# EAGLE schematic Top (EAGLE 9.2.2)

## Sheet 1 of 3
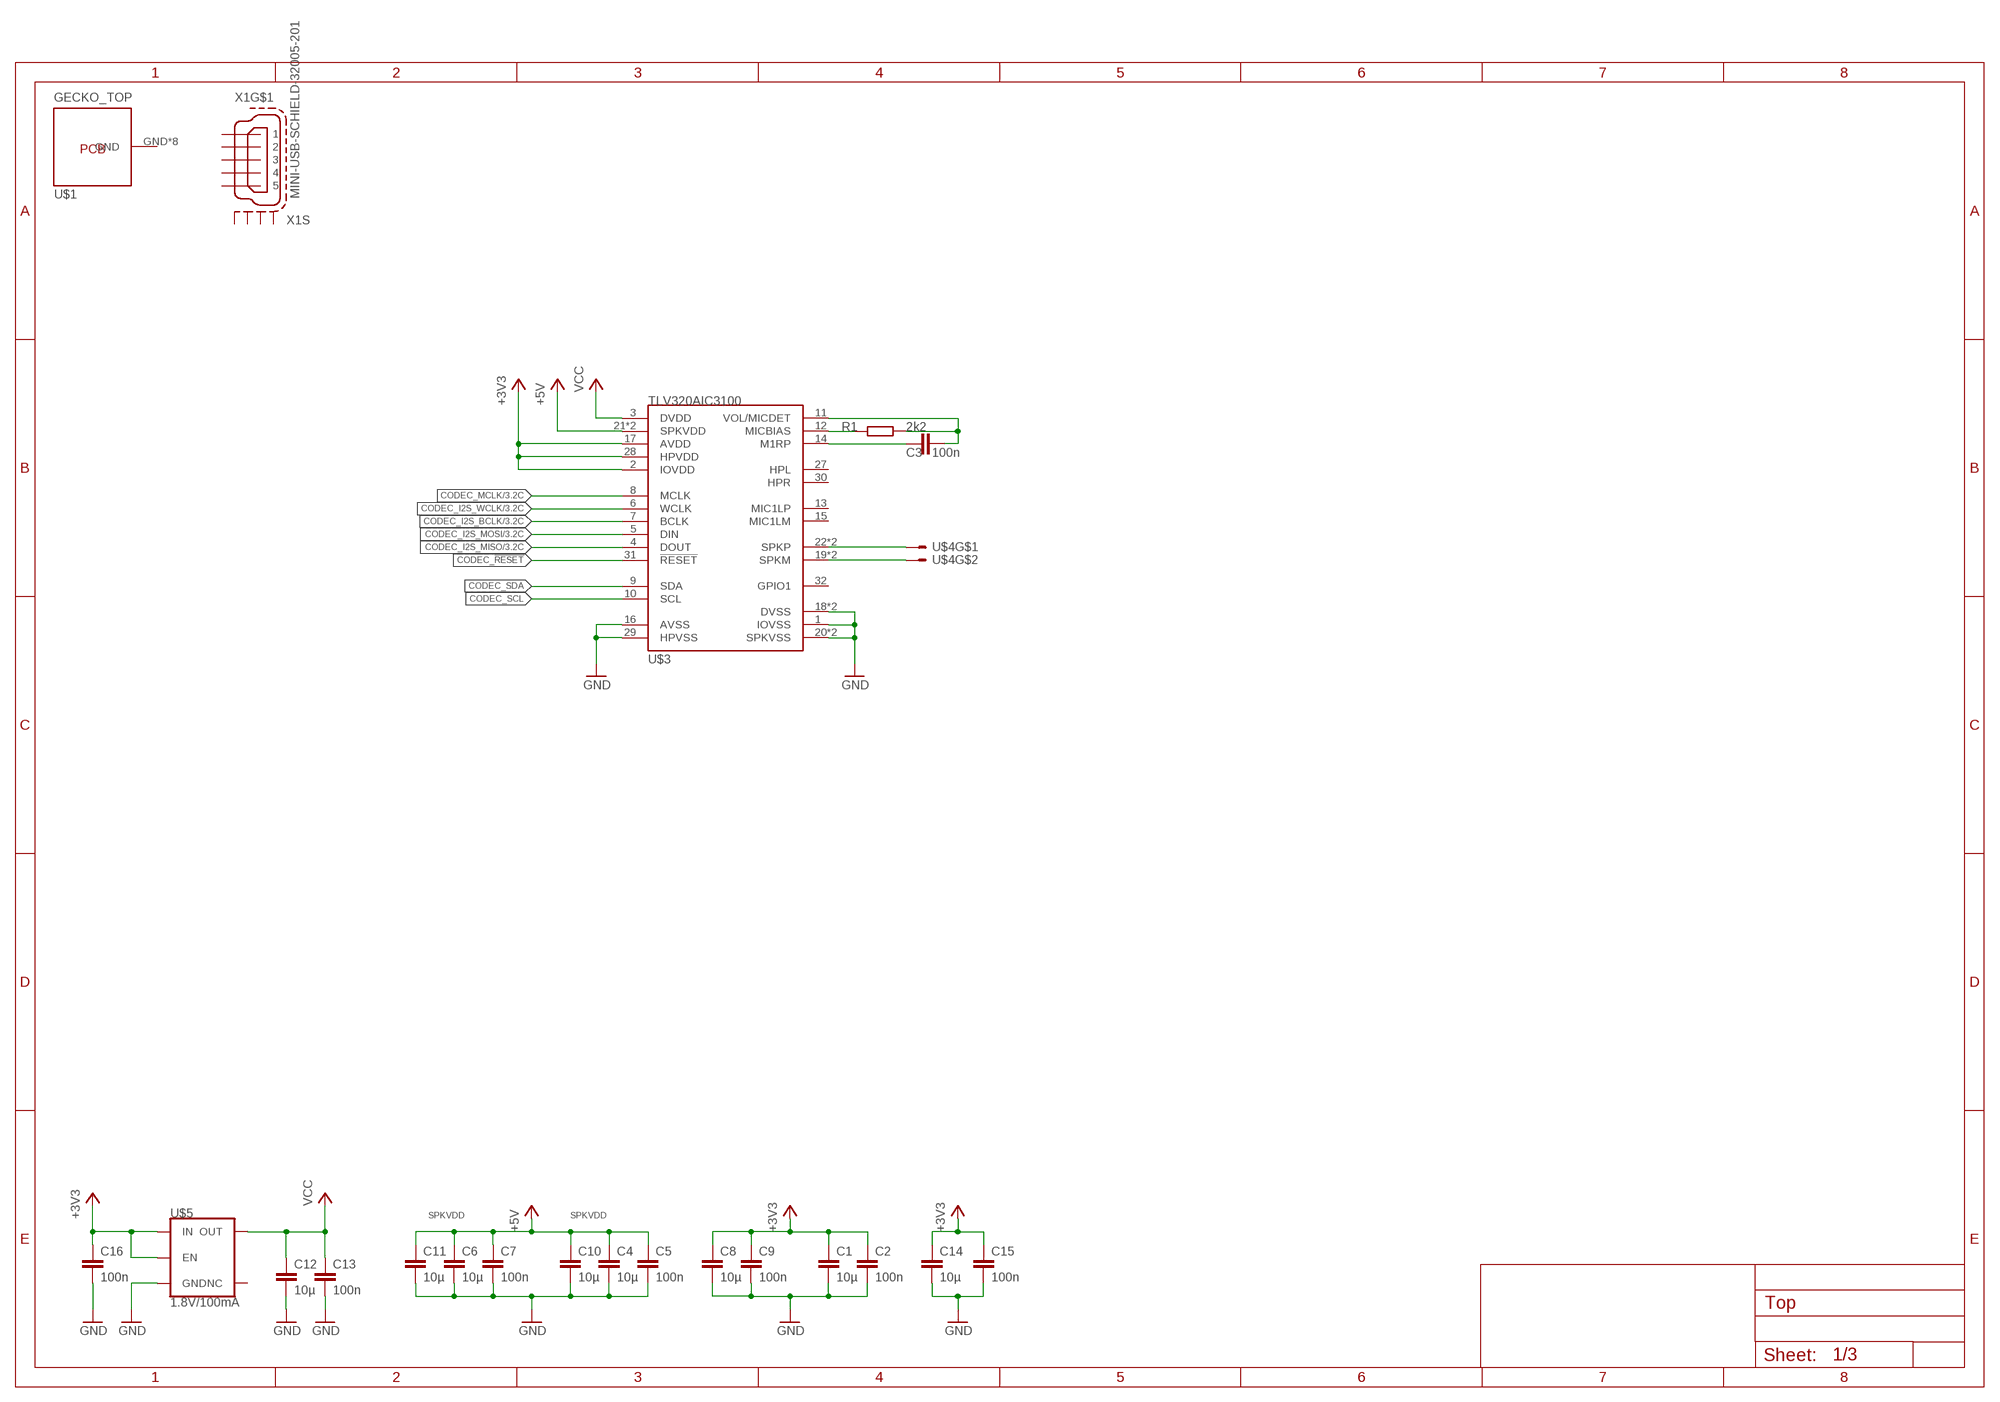
[diagram p0: schematic, sheet 1]

### Parts
C1  10µ  C-EUC0805  [C0805]
C2  100n  C-EUC0805  [C0805]
C3  100n  C-EUC0805  [C0805]
C4  10µ  C-EUC0805  [C0805]
C5  100n  C-EUC0805  [C0805]
C6  10µ  C-EUC0805  [C0805]
C7  100n  C-EUC0805  [C0805]
C8  10µ  C-EUC0805  [C0805]
C9  100n  C-EUC0805  [C0805]
C10  10µ  C-EUC0805  [C0805]
C11  10µ  C-EUC0805  [C0805]
C12  10µ  C-EUC0805  [C0805]
C13  100n  C-EUC0805  [C0805]
C14  10µ  C-EUC0805  [C0805]
C15  100n  C-EUC0805  [C0805]
C16  100n  C-EUC0805  [C0805]
R1  2k2  R-EU_R0402  [R0402]
U$1  GECKO_TOP  [GECKO_TOP]
U$3  TLV320AIC3100  [QFN32]
U$4  JST-SH-2-SMT  [JST-SH-2-SMT]
U$5  1.8V/100mA  V_REG_SP6214-1.8V  [SC70]
X1  MINI-USB-SCHIELD-32005-201  [32005-201]

### Nets
+3V3: C1.1 C2.1 C8.1 C9.1 C14.1 C15.1 C16.1 U$3.2(IOVDD) U$3.17(AVDD) U$3.28(HPVDD) U$5.1(IN) U$5.3(EN)
+5V: C4.1 C5.1 C6.1 C7.1 C10.1 C11.1 U$3.21(SPKVDD) U$3.24(SPKVDD)
CODEC_!RESET: U$3.31(!RESET)
CODEC_I2S_BCLK: U$3.7(BCLK) ; also sheet 3
CODEC_I2S_MISO: U$3.4(DOUT) ; also sheet 3
CODEC_I2S_MOSI: U$3.5(DIN) ; also sheet 3
CODEC_I2S_WCLK: U$3.6(WCLK) ; also sheet 3
CODEC_MCLK: U$3.8(MCLK) ; also sheet 3
CODEC_SCL: U$3.10(SCL)
CODEC_SDA: U$3.9(SDA)
GND: C1.2 C2.2 C4.2 C5.2 C6.2 C7.2 C8.2 C9.2 C10.2 C11.2 C12.2 C13.2 C14.2 C15.2 C16.2 U$3.1(IOVSS) U$3.16(AVSS) U$3.18(DVSS) U$3.20(SPKVSS) U$3.25(SPKVSS) U$3.29(HPVSS) U$3.EXP(DVSS) U$5.2(GND) ; also sheet 3
N$1: U$3.22(SPKP) U$3.26(SPKP) U$4.1
N$2: R1.1 U$3.12(MICBIAS)
N$3: C3.1 U$3.14(M1RP)
N$4: C3.2 R1.2 U$3.11(VOL/MICDET)
N$10: U$3.19(SPKM) U$3.23(SPKM) U$4.2
VCC: C12.1 C13.1 U$3.3(DVDD) U$5.5(OUT) ; also sheet 3
Unconnected: U$1.GND U$1.GND1(GND) U$1.GND2(GND) U$1.GND3(GND) U$1.P$1(GND) U$1.P$2(GND) U$1.P$3(GND) U$1.P$4(GND) U$3.13(MIC1LP) U$3.15(MIC1LM) U$3.27(HPL) U$3.30(HPR) U$3.32(GPIO1) U$5.4(NC) X1.1 X1.2 X1.3 X1.4 X1.5 X1.M1(S:S1) X1.M2(S:S2) X1.M3(S:S3) X1.M4(S:S4)

### Notes on the sheet
- SPKVDD | SPKVDD

## Sheet 2 of 3: Display Management
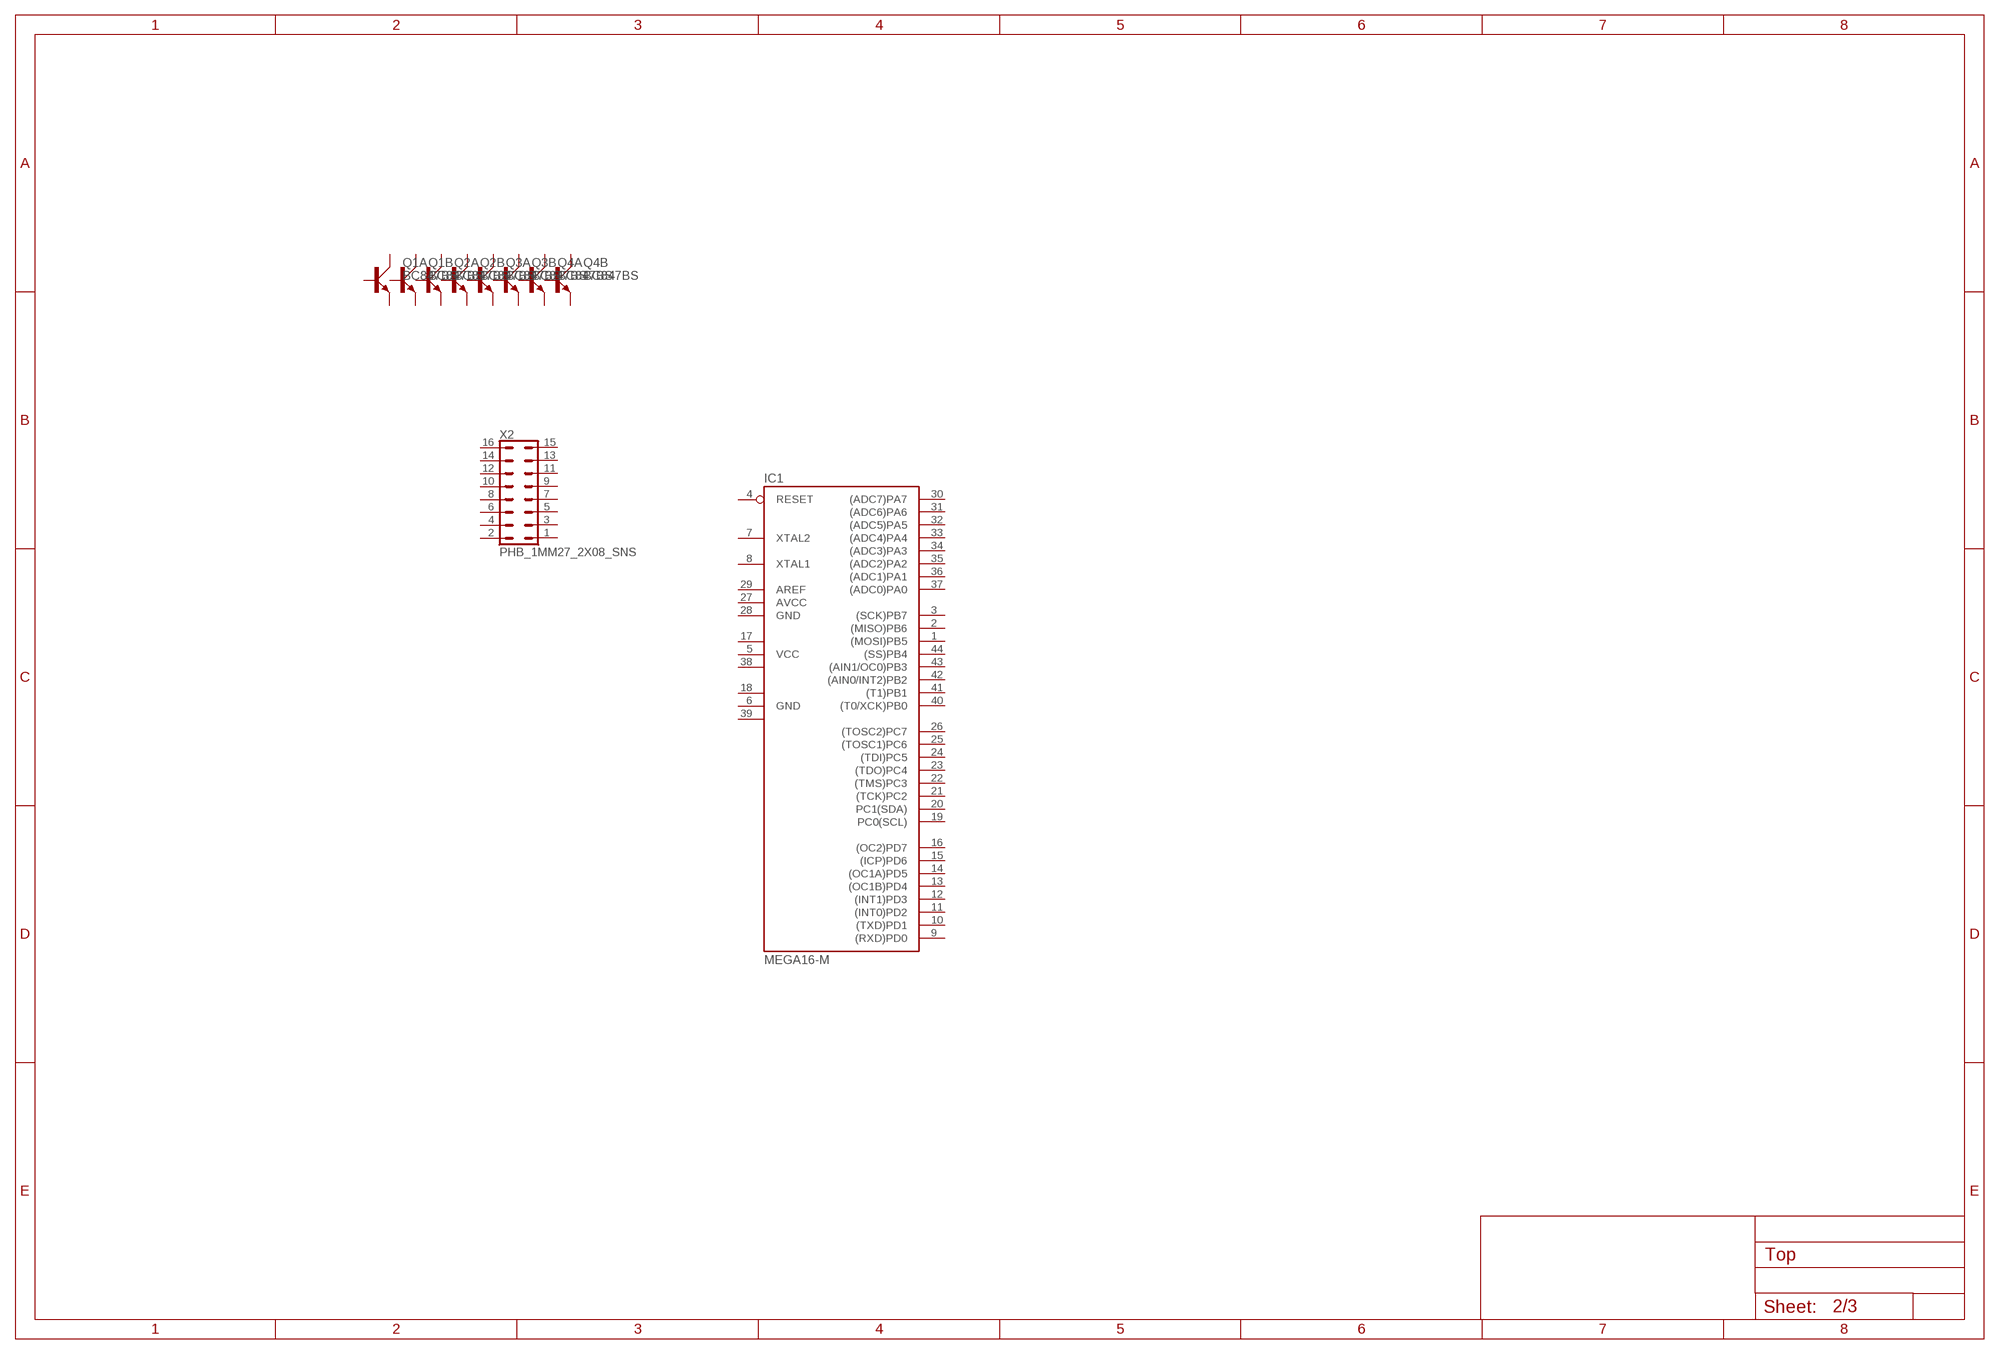
[diagram p1: schematic, sheet 2]

### Parts
IC1  MEGA16-M  [MLF44]
Q1  BC847BS  [SOT363_PHILIPS]
Q2  BC847BS  [SOT363_PHILIPS]
Q3  BC847BS  [SOT363_PHILIPS]
Q4  BC847BS  [SOT363_PHILIPS]
X2  PHB_1MM27_2X08_SNS  [PHB_1MM27_2X08_SNS]
Unconnected: IC1.1((MOSI)PB5) IC1.2((MISO)PB6) IC1.3((SCK)PB7) IC1.4(RESET) IC1.7(XTAL2) IC1.8(XTAL1) IC1.9((RXD)PD0) IC1.10((TXD)PD1) IC1.11((INT0)PD2) IC1.12((INT1)PD3) IC1.13((OC1B)PD4) IC1.14((OC1A)PD5) IC1.15((ICP)PD6) IC1.16((OC2)PD7) IC1.19(PC0(SCL)) IC1.20(PC1(SDA)) IC1.21((TCK)PC2) IC1.22((TMS)PC3) IC1.23((TDO)PC4) IC1.24((TDI)PC5) IC1.25((TOSC1)PC6) IC1.26((TOSC2)PC7) IC1.29(AREF) IC1.30((ADC7)PA7) IC1.31((ADC6)PA6) IC1.32((ADC5)PA5) IC1.33((ADC4)PA4) IC1.34((ADC3)PA3) IC1.35((ADC2)PA2) IC1.36((ADC1)PA1) IC1.37((ADC0)PA0) IC1.40((T0/XCK)PB0) IC1.41((T1)PB1) IC1.42((AIN0/INT2)PB2) IC1.43((AIN1/OC0)PB3) IC1.44((SS)PB4) Q1.1(A:E) Q1.2(A:B) Q1.3(B:C) Q1.4(B:E) Q1.5(B:B) Q1.6(A:C) Q2.1(A:E) Q2.2(A:B) Q2.3(B:C) Q2.4(B:E) Q2.5(B:B) Q2.6(A:C) Q3.1(A:E) Q3.2(A:B) Q3.3(B:C) Q3.4(B:E) Q3.5(B:B) Q3.6(A:C) Q4.1(A:E) Q4.2(A:B) Q4.3(B:C) Q4.4(B:E) Q4.5(B:B) Q4.6(A:C) X2.1 X2.2 X2.3 X2.4 X2.5 X2.6 X2.7 X2.8 X2.9 X2.10 X2.11 X2.12 X2.13 X2.14 X2.15 X2.16

## Sheet 3 of 3
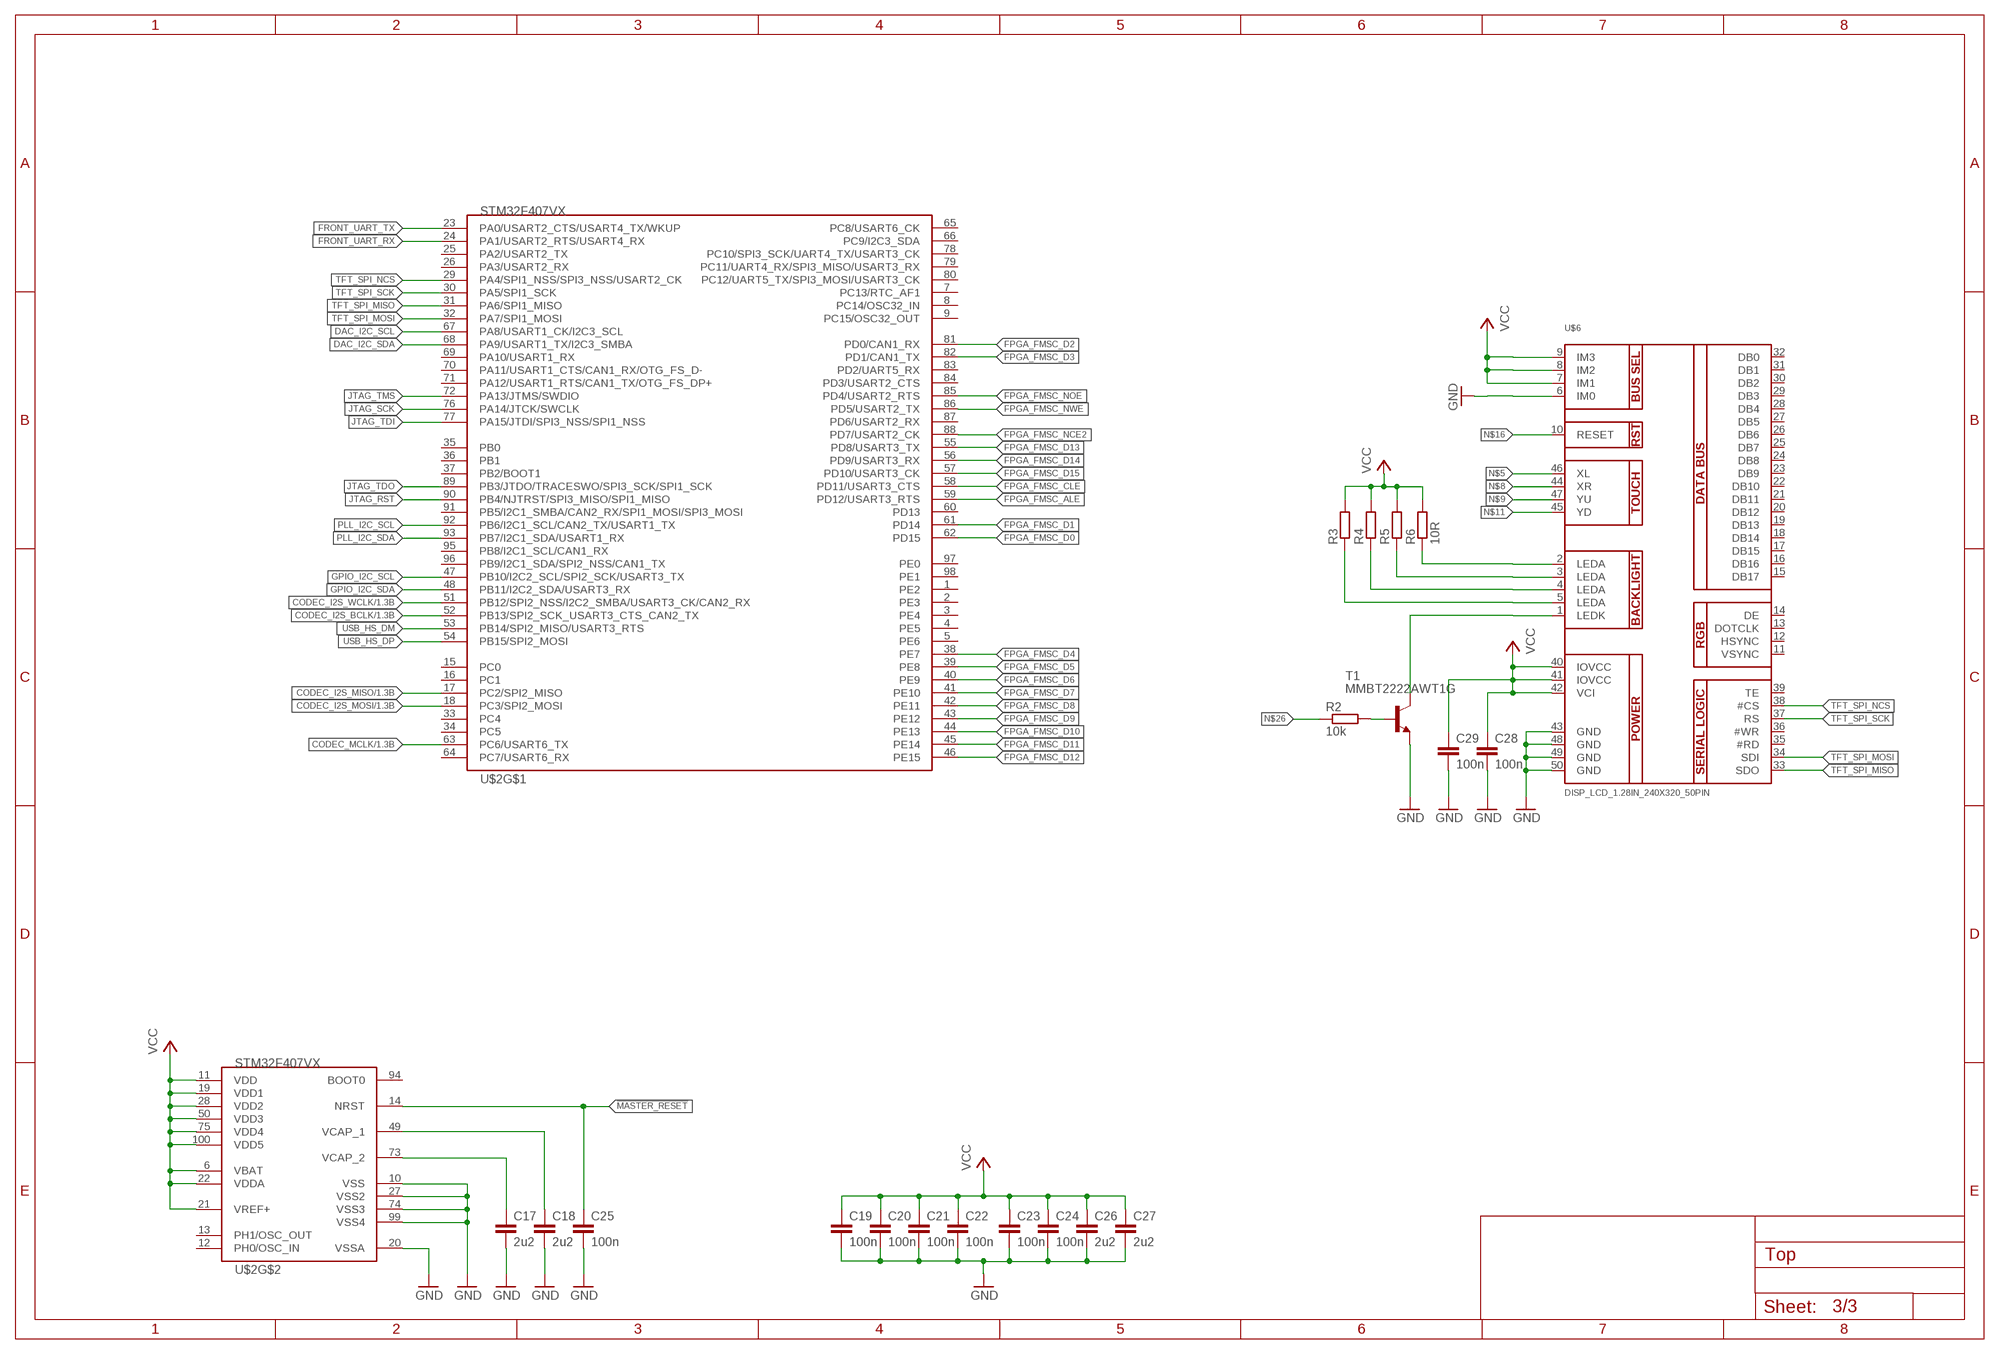
[diagram p2: schematic, sheet 3]

### Parts
C17  2u2  C-EUC0805  [C0805]
C18  2u2  C-EUC0805  [C0805]
C19  100n  C-EUC0402  [C0402]
C20  100n  C-EUC0402  [C0402]
C21  100n  C-EUC0402  [C0402]
C22  100n  C-EUC0402  [C0402]
C23  100n  C-EUC0402  [C0402]
C24  100n  C-EUC0402  [C0402]
C25  100n  C-EUC0402  [C0402]
C26  2u2  C-EUC0805  [C0805]
C27  2u2  C-EUC0805  [C0805]
C28  100n  C-EUC0402  [C0402]
C29  100n  C-EUC0402  [C0402]
R2  10k  R-EU_R0402  [R0402]
R3  10R  R-EU_R0805  [R0805]
R4  10R  R-EU_R0805  [R0805]
R5  10R  R-EU_R0805  [R0805]
R6  10R  R-EU_R0805  [R0805]
T1  MMBT2222AWT1G  MMBT2222ALT1-NPN-SOT23-BEC  [SOT23-BEC]
U$2  STM32F407VX  [LQFP100]
U$6  DISP_LCD_1.28IN_240X320_50PIN  [TFT_2.83IN_240X320_50PIN]

### Nets
!MASTER_RESET: C25.1 U$2.14(NRST)
CODEC_I2S_BCLK: U$2.52(PB13/SPI2_SCK_USART3_CTS_CAN2_TX) ; also sheet 1
CODEC_I2S_MISO: U$2.17(PC2/SPI2_MISO) ; also sheet 1
CODEC_I2S_MOSI: U$2.18(PC3/SPI2_MOSI) ; also sheet 1
CODEC_I2S_WCLK: U$2.51(PB12/SPI2_NSS/I2C2_SMBA/USART3_CK/CAN2_RX) ; also sheet 1
CODEC_MCLK: U$2.63(PC6/USART6_TX) ; also sheet 1
DAC_I2C_SCL: U$2.67(PA8/USART1_CK/I2C3_SCL)
DAC_I2C_SDA: U$2.68(PA9/USART1_TX/I2C3_SMBA)
FPGA_FMSC_ALE: U$2.59(PD12/USART3_RTS)
FPGA_FMSC_CLE: U$2.58(PD11/USART3_CTS)
FPGA_FMSC_D0: U$2.62(PD15)
FPGA_FMSC_D1: U$2.61(PD14)
FPGA_FMSC_D2: U$2.81(PD0/CAN1_RX)
FPGA_FMSC_D3: U$2.82(PD1/CAN1_TX)
FPGA_FMSC_D4: U$2.38(PE7)
FPGA_FMSC_D5: U$2.39(PE8)
FPGA_FMSC_D6: U$2.40(PE9)
FPGA_FMSC_D7: U$2.41(PE10)
FPGA_FMSC_D8: U$2.42(PE11)
FPGA_FMSC_D9: U$2.43(PE12)
FPGA_FMSC_D10: U$2.44(PE13)
FPGA_FMSC_D11: U$2.45(PE14)
FPGA_FMSC_D12: U$2.46(PE15)
FPGA_FMSC_D13: U$2.55(PD8/USART3_TX)
FPGA_FMSC_D14: U$2.56(PD9/USART3_RX)
FPGA_FMSC_D15: U$2.57(PD10/USART3_CK)
FPGA_FMSC_NCE2: U$2.88(PD7/USART2_CK)
FPGA_FMSC_NOE: U$2.85(PD4/USART2_RTS)
FPGA_FMSC_NWE: U$2.86(PD5/USART2_TX)
FRONT_UART_RX: U$2.24(PA1/USART2_RTS/USART4_RX)
FRONT_UART_TX: U$2.23(PA0/USART2_CTS/USART4_TX/WKUP)
GND: C17.2 C18.2 C19.2 C20.2 C21.2 C22.2 C23.2 C24.2 C25.2 C26.2 C27.2 C28.2 C29.2 T1.E U$2.10(VSS) U$2.20(VSSA) U$2.27(VSS2) U$2.74(VSS3) U$2.99(VSS4) U$6.6(IM0) U$6.43(GND) U$6.48(GND) U$6.49(GND) U$6.50(GND) ; also sheet 1
GPIO_I2C_SCL: U$2.47(PB10/I2C2_SCL/SPI2_SCK/USART3_TX)
GPIO_I2C_SDA: U$2.48(PB11/I2C2_SDA/USART3_RX)
JTAG_RST: U$2.90(PB4/NJTRST/SPI3_MISO/SPI1_MISO)
JTAG_SCK: U$2.76(PA14/JTCK/SWCLK)
JTAG_TDI: U$2.77(PA15/JTDI/SPI3_NSS/SPI1_NSS)
JTAG_TDO: U$2.89(PB3/JTDO/TRACESWO/SPI3_SCK/SPI1_SCK)
JTAG_TMS: U$2.72(PA13/JTMS/SWDIO)
N$5: U$6.46(XL)
N$6: C17.1 U$2.73(VCAP_2)
N$7: C18.1 U$2.49(VCAP_1)
N$8: U$6.44(XR)
N$9: U$6.47(YU)
N$11: U$6.45(YD)
N$15: U$6.9(IM3)
N$16: U$6.10(RESET)
N$20: T1.C U$6.1(LEDK)
N$21: R6.1 U$6.2(LEDA)
N$22: R5.1 U$6.3(LEDA)
N$23: R4.1 U$6.4(LEDA)
N$24: R3.1 U$6.5(LEDA)
N$25: R2.2 T1.B
N$26: R2.1
PLL_I2C_SCL: U$2.92(PB6/I2C1_SCL/CAN2_TX/USART1_TX)
PLL_I2C_SDA: U$2.93(PB7/I2C1_SDA/USART1_RX)
TFT_SPI_MISO: U$2.31(PA6/SPI1_MISO) U$6.33(SDO)
TFT_SPI_MOSI: U$2.32(PA7/SPI1_MOSI) U$6.34(SDI)
TFT_SPI_NCS: U$2.29(PA4/SPI1_NSS/SPI3_NSS/USART2_CK) U$6.38(#CS)
TFT_SPI_SCK: U$2.30(PA5/SPI1_SCK) U$6.37(RS)
USB_HS_DM: U$2.53(PB14/SPI2_MISO/USART3_RTS)
USB_HS_DP: U$2.54(PB15/SPI2_MOSI)
VCC: C19.1 C20.1 C21.1 C22.1 C23.1 C24.1 C26.1 C27.1 C28.1 C29.1 R3.2 R4.2 R5.2 R6.2 U$2.6(VBAT) U$2.11(VDD) U$2.19(VDD1) U$2.21(VREF+) U$2.22(VDDA) U$2.28(VDD2) U$2.50(VDD3) U$2.75(VDD4) U$2.100(VDD5) U$6.7(IM1) U$6.8(IM2) U$6.40(IOVCC) U$6.41(IOVCC) U$6.42(VCI) ; also sheet 1
Unconnected: U$2.1(PE2) U$2.2(PE3) U$2.3(PE4) U$2.4(PE5) U$2.5(PE6) U$2.7(PC13/RTC_AF1) U$2.8(PC14/OSC32_IN) U$2.9(PC15/OSC32_OUT) U$2.12(PH0/OSC_IN) U$2.13(PH1/OSC_OUT) U$2.15(PC0) U$2.16(PC1) U$2.25(PA2/USART2_TX) U$2.26(PA3/USART2_RX) U$2.33(PC4) U$2.34(PC5) U$2.35(PB0) U$2.36(PB1) U$2.37(PB2/BOOT1) U$2.60(PD13) U$2.64(PC7/USART6_RX) U$2.65(PC8/USART6_CK) U$2.66(PC9/I2C3_SDA) U$2.69(PA10/USART1_RX) U$2.70(PA11/USART1_CTS/CAN1_RX/OTG_FS_D-) U$2.71(PA12/USART1_RTS/CAN1_TX/OTG_FS_DP+) U$2.78(PC10/SPI3_SCK/UART4_TX/USART3_CK) U$2.79(PC11/UART4_RX/SPI3_MISO/USART3_RX) U$2.80(PC12/UART5_TX/SPI3_MOSI/USART3_CK) U$2.83(PD2/UART5_RX) U$2.84(PD3/USART2_CTS) U$2.87(PD6/USART2_RX) U$2.91(PB5/I2C1_SMBA/CAN2_RX/SPI1_MOSI/SPI3_MOSI) U$2.94(BOOT0) U$2.95(PB8/I2C1_SCL/CAN1_RX) U$2.96(PB9/I2C1_SDA/SPI2_NSS/CAN1_TX) U$2.97(PE0) U$2.98(PE1) U$6.11(VSYNC) U$6.12(HSYNC) U$6.13(DOTCLK) U$6.14(DE) U$6.15(DB17) U$6.16(DB16) U$6.17(DB15) U$6.18(DB14) U$6.19(DB13) U$6.20(DB12) U$6.21(DB11) U$6.22(DB10) U$6.23(DB9) U$6.24(DB8) U$6.25(DB7) U$6.26(DB6) U$6.27(DB5) U$6.28(DB4) U$6.29(DB3) U$6.30(DB2) U$6.31(DB1) U$6.32(DB0) U$6.35(#RD) U$6.36(#WR) U$6.39(TE)

## Power pins joined to a net without a drawn wire
AVCC: IC1.27(AVCC)
GND: IC1.6(GND) IC1.28(GND)
GND1: IC1.18(GND1)
GND2: IC1.39(GND2)
VCC: IC1.5(VCC)
VCC1: IC1.17(VCC1)
VCC2: IC1.38(VCC2)

## Library data of the parts
C1-C29 = rcl:C-EU: CAPACITOR, European symbol; SPICEPREFIX: C
IC1 = atmel:MEGA16: MICROCONTROLLER 16 Kbytes FLASH 1 kbytes SRAM 512 bytes EEPROM USART 8-channel 10 bit ADC Source: avr.lbr; MPN: ATMEGA16-16MU; OC_FARNELL: 1455107; OC_NEWARK: 58M3723
Q1-Q4 = transistor-small-signal:BC847BS: NPN general purpose double transistor Source: http://www.farnell.com/datasheets/2466.pdf
R1-R6 = rcl:R-EU_: RESISTOR, European symbol; SPICEPREFIX: R
T1 = transistor:*-NPN-: NPN Transistror BF959 corrected 2008.03.06
U$1 = MyLib:GECKO_TOP
U$2 = MyLib:STM32F407VX: STmicroelectronics Cortex M4 Series Typ: STM32F407Vx LQFP100 Copyright 2012 by Ersan Günes, Quantitec, info@quantitec.de
U$3 = MyLib:TLV320AIC3100
U$4 = MyLib:JST-SH-2-SMT
U$5 = SparkFun-IC-Power:V_REG_SP6214: Voltage Regulator - SP6214 SP6214 Series SC-70-5 Micropower SC-70 100 mA CMOS LDO Regulator Datasheet <https://www.exar.com/content/document.ashx?id=654> SparkFun Products: MP3 Trigger <https://www.sparkfun.com/products/13720> SparkFun Particle Sensor Breakout <https://www.sparkfun.com/products/14045>; PROD_ID: VREG-08428
U$6 = MyLib:DISP_LCD_1.28IN_240X320_50PIN
X1 = con-cypressindustries:MINI-USB-SCHIELD-: MINI USB-B Conector Source: www.cypressindustries.com; OC_FARNELL: unknown; OC_NEWARK: unknown
X2 = _hhn_con_pinhead_box_1mm27:PHB_1MM27_2X08_*: Pin Header Box-Type, 1.27mm/0.5"/50mil Pitch, 2x08 Circuits Note: see library description for an important note about THT-version